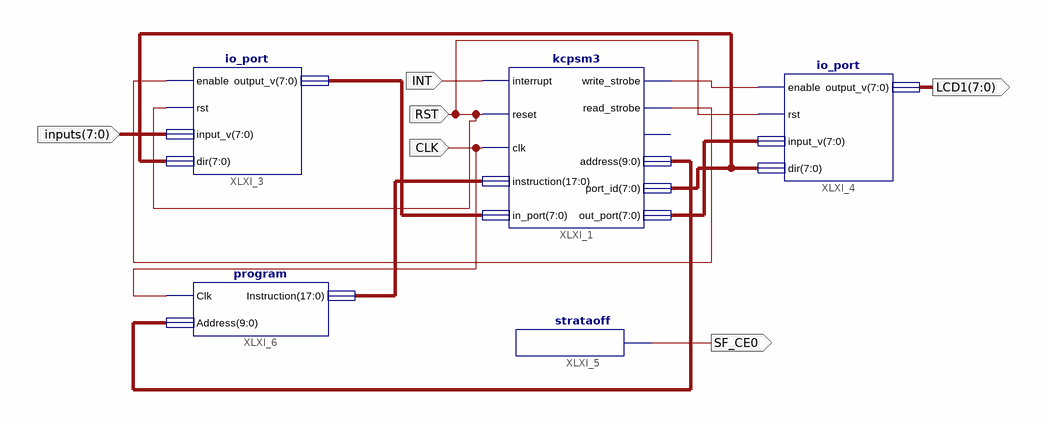
[diagram p0: schematic sheet 1]
// Xilinx ISE schematic todo.sch (spartan3e) as structural Verilog: 5 symbols, 6 ports
module todo (
  input  CLK,
  input  RST,
  input  INT,
  input  [7:0] inputs,
  output [7:0] LCD1,
  output SF_CE0
);

  wire XLXN_5, XLXN_6;
  wire [7:0] XLXN_1, XLXN_7, XLXN_9;
  wire [9:0] XLXN_4;
  wire [17:0] XLXN_2;

  kcpsm3 XLXI_1 (
    .interrupt(INT), .reset(RST), .clk(CLK), .instruction(XLXN_2), .in_port(XLXN_1), .write_strobe(XLXN_6),
    .read_strobe(XLXN_5), .address(XLXN_4), .port_id(XLXN_9), .out_port(XLXN_7));  // open: interrupt_ack
  io_port XLXI_3 (.enable(XLXN_5), .rst(RST), .input_v(inputs), .dir(XLXN_9), .output_v(XLXN_1));
  io_port XLXI_4 (.enable(XLXN_6), .rst(RST), .input_v(XLXN_7), .dir(XLXN_9), .output_v(LCD1));
  strataoff XLXI_5 (.op(SF_CE0));
  \program  XLXI_6 (.Clk(CLK), .Address(XLXN_4), .Instruction(XLXN_2));
endmodule
